# EAGLE design FireflyRevB (EAGLE 9.0.1)
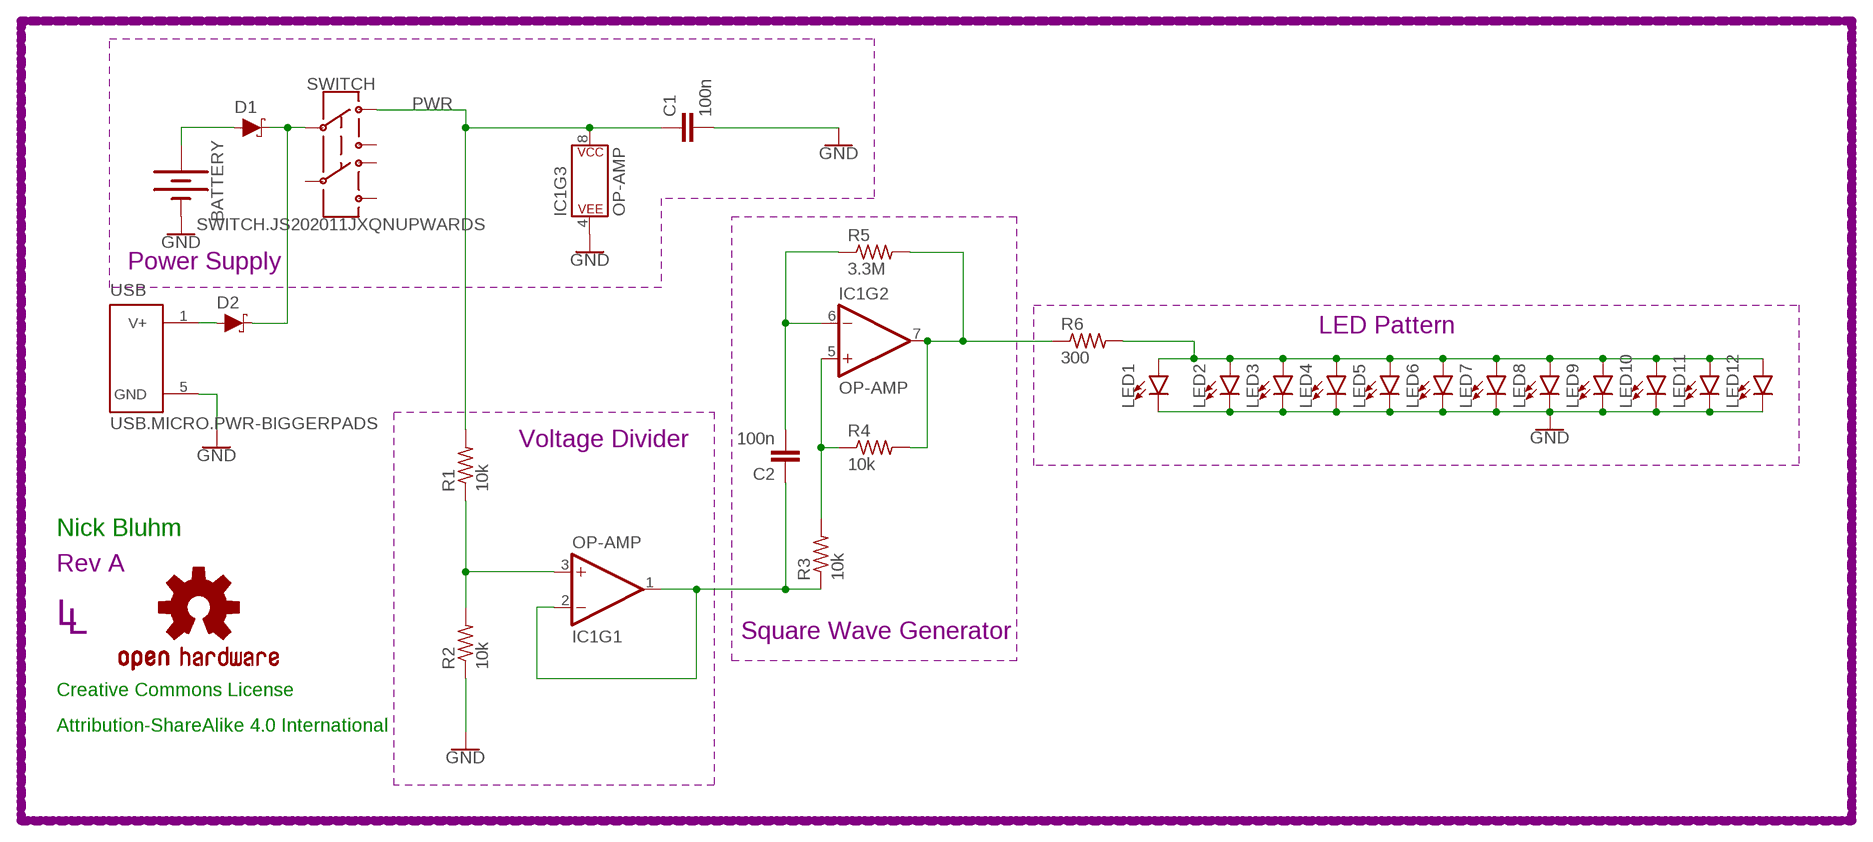
[diagram p0: schematic, sheet 1]

## Parts
BATTERY  BATTERY-20MM_SMD  [BATTCON_20MM]
C1  100n  CAPACITOR0603  [C0603]
C2  100n  CAPACITOR0603  [C0603]
D1  SCHOTTKY-USC  [USC]
D2  SCHOTTKY-USC  [USC]
IC1  OP-AMP  OPAMP-DUALU  [SO08]
LED1  LED5MM  [LED_5MM]
LED2  LED5MM  [LED_5MM]
LED3  LED5MM  [LED_5MM]
LED4  LED5MM  [LED_5MM]
LED5  LED5MM  [LED_5MM]
LED6  LED5MM  [LED_5MM]
LED7  LED5MM  [LED_5MM]
LED8  LED5MM  [LED_5MM]
LED9  LED5MM  [LED_5MM]
LED10  LED5MM  [LED_5MM]
LED11  LED5MM  [LED_5MM]
LED12  LED5MM  [LED_5MM]
LOGO1  OSHW-LOGOL-COPPER  [OSHW-LOGO-L_COPPER]
R1  10k  RESISTOR0603  [R0603]
R2  10k  RESISTOR0603  [R0603]
R3  10k  RESISTOR0603  [R0603]
R4  10k  RESISTOR0603  [R0603]
R5  3.3M  RESISTOR0603  [R0603]
R6  300  RESISTOR0603  [R0603]
SWITCH  SWITCH.JS202011JXQNUPWARDS  [SWITCH.00]
U$4  REVISION.A  [REV.A]
U$5  LINNES.LAB.LOGO  [LINNES.LAB.LOGO]
USB  USB.MICRO.PWR-BIGGERPADS  [USB-MICRO-01.BIGGERPADS.PWR]

## Nets
GND: BATTERY.2(-) C1.2 IC1.4(P$V-) LED1.K(C) LED2.K(C) LED3.K(C) LED4.K(C) LED5.K(C) LED6.K(C) LED7.K(C) LED8.K(C) LED9.K(C) LED10.K(C) LED11.K(C) LED12.K(C) R2.1 USB.5(GND)
N$1: D1.-(C) D2.-(C) SWITCH.2
N$2: IC1.3(+IN) R1.1 R2.2
N$3: LED1.A LED2.A LED3.A LED4.A LED5.A LED6.A LED7.A LED8.A LED9.A LED10.A LED11.A LED12.A R6.2
N$4: C2.1 IC1.1(OUT) IC1.2(-IN) R3.1
N$5: C2.2 IC1.6(-IN) R5.1
N$6: IC1.5(+IN) R3.2 R4.1
N$7: IC1.7(OUT) R4.2 R5.2 R6.1
N$9: BATTERY.1(+) D1.+(A)
N$11: D2.+(A) USB.1(V+)
PWR: C1.1 IC1.8(P$V+) R1.2 SWITCH.1
Unconnected: SWITCH.3 SWITCH.5 SWITCH.6 SWITCH.7

## Notes on the sheet
- Power Supply
- LED Pattern
- Voltage Divider
- Nick Bluhm
- Square Wave Generator
- Creative Commons License
- Attribution-ShareAlike 4.0 International

## Library data of the parts
BATTERY = SparkFun-Batteries:BATTERY: Battery - Single Cell A variety of battery chemistries, sizes, and footprints. Device List: 20MM_PTH - Coin Cell Battery Holder - 20mm (PTH) <https://www.sparkfun.com/products/783> 6.8MM_PTH - Coin Cell Battery Holder - 6.8MM(SMD) <https://www.digikey.com/product-detail/en/seiko-instruments/MS621FE-FL11E/728-1057-ND/1889208?WT.srch=1&gclid=CNOQ5a6LzdQCFZS2wAodXCkE0g> 12MM_SMD - Coin Cell Battery Holder - 12mm (SMD) <https://www.sparkfun.com/products/10592> 12MM_PTH - Coin Cell Battery Holder - 12mm (PTH) <https://www.sparkfun.com/products/7948> 20MM_SMD - 20mm Coin Cell Battery Holder (SMD) (2 legs) Used on the Big Time Watch Kit <https://www.sparkfun.com/products/11734> 20MM_SMD_4LEGS - Coin Cell Battery Holder - 20mm (SMD) <https://www.sparkfun.com/products/11892> 20MM_SMD_4LEGS_OVERPASTE - Coin Cell Battery Holder - 20mm (SMD) <https://www.sparkfun.com/products/11892> (Over-paste on the legs) 24.5MM_PTH - Coin Cell Battery Holder - 24.5mm (PTH) <https://www.sparkfun.com/products/8863> 9V - 9V Battery Holder - PC Mount Used on the SparkFun SparkPunk Sound Kit <https://www.sparkfun.com/products/11177> and SparkFun SparkPunk Sequencer Kit <https://www.sparkfun.com/products/12707> 18650 - Battery Holder - 18650 (PTH) <https://www.sparkfun.com/products/13113> AA - Battery Holder - 1xAA (PTH) <https://www.sparkfun.com/products/7949> AAA - Battery Holder - 1xAAA (PTH) <https://www.sparkfun.com/products/12718> AA_KIT - Battery Holder - 1xAA (PTH) <https://www.sparkfun.com/products/7949> Special kit package - pads only have exposed copper on one side of the board. AAA_KIT - Battery Holder - 1xAAA (PTH) <https://www.sparkfun.com/products/12718> Special kit package - pads only have exposed copper on one side of the board.; PROD_ID: BATT-11519
C1 C2 = CalvEngIO-Passives:CAPACITOR
D1 D2 = CalvEngIO-DiscreteSemi:SCHOTTKY: Schottky diode A Schottky diode is a semiconductor diode which has a low forward voltage drop and a very fast switching action. Example: Digi-Key Part Number: RB161MM-20CT-ND
IC1 = SparkFun-IC-Amplifiers:OPAMP-DUAL: Generic op-amp footprint This component is for the standard 358 pinning of a dual op-amp From the LM358 datasheet: Pin 1: Output A Pin 2: Inverting Input A Pin 3: Non-Inverting Input A Pin 4: Gnd Pin 5: Non-Inverting Input B Pin 6: Inverting Input B Pin 7: Output B Pin 8: V+; PROD_ID: NA-XXXXX
LED1-LED12 = CalvEngIO-LED:LED: LED (Generic) Standard schematic elements and footprints for 5mm, 3mm, 1206, and 0603 sized LEDs. Generic LEDs with no color specified. LTST-C190KGKT: arrow indicates cathode
LOGO1 = CalvEngIO-Logos:OSHW-LOGO: Open-Source Hardware (OSHW) Logo This logo indicates the piece of hardware it is found on incorporates a OSHW license and/or adheres to the definition of open source hardware found here: http://freedomdefined.org/OSHW
R1-R6 = CalvEngIO-Passives:RESISTOR
SWITCH = CalvEngIO-Switches:SWITCH.JS202011JXQN: Manufacturer's Part Numer: JS202011JAQN for right angle throw JS202011JCQN for top side throw
U$4 = CalvEngIO-Symbols:REVISION.A
U$5 = CalvEngIO-Logos:LINNES.LAB.LOGO
USB = CalvEngIO-Connectors:USB.MICRO.PWR

## Board
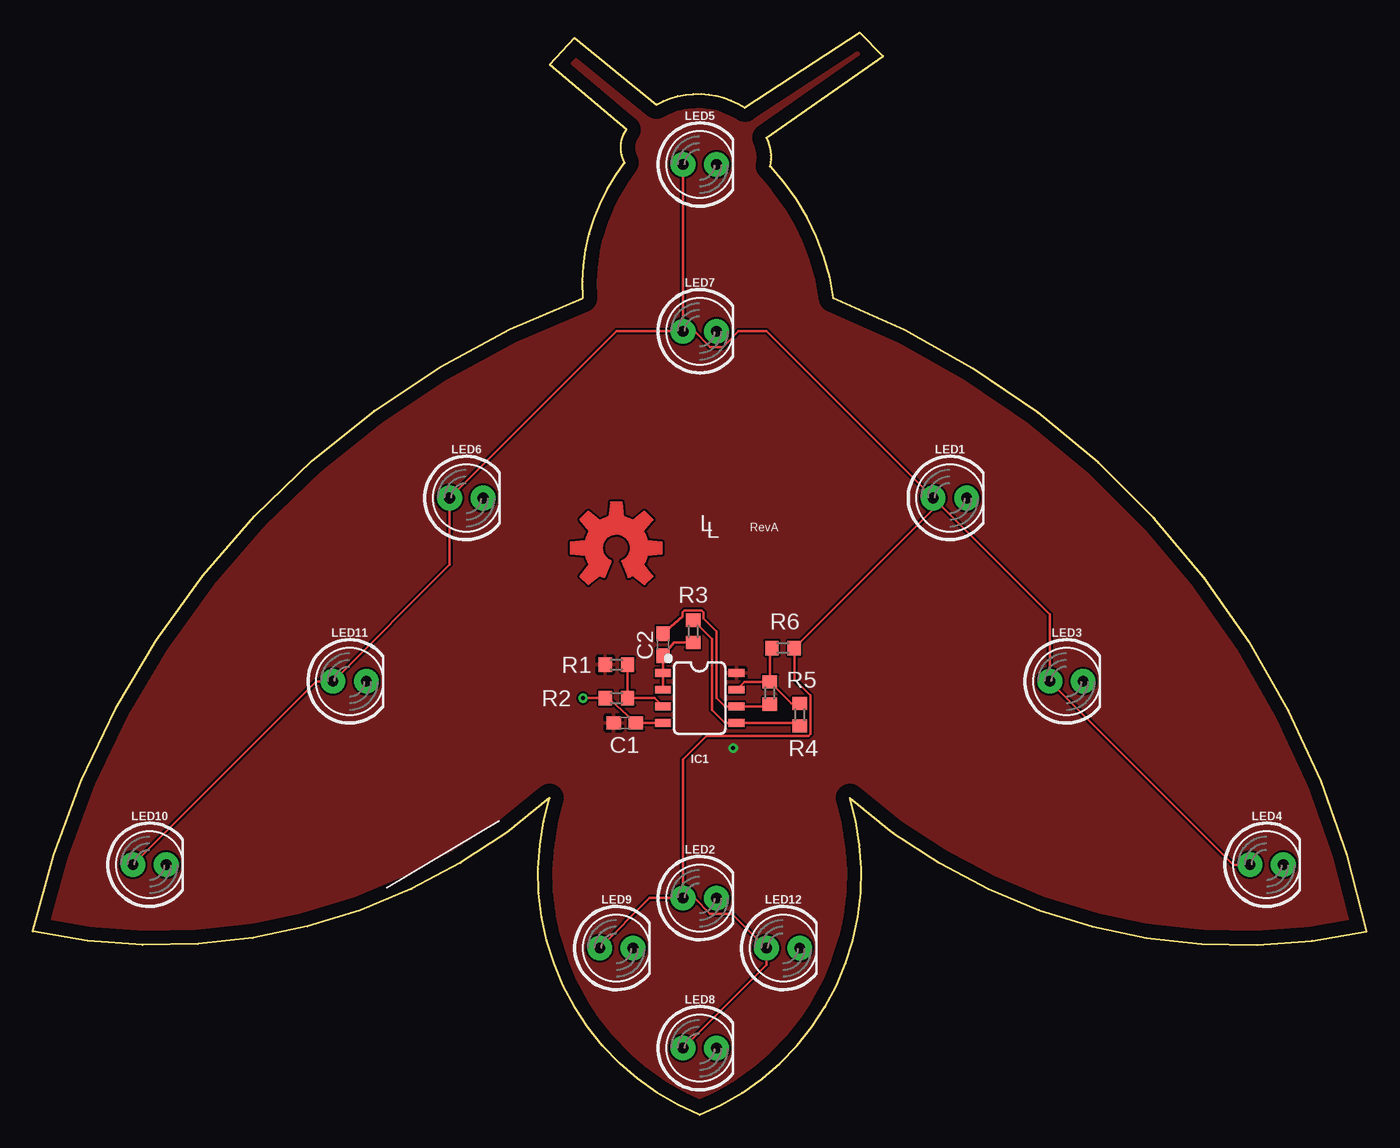
[diagram p1: board, top side]
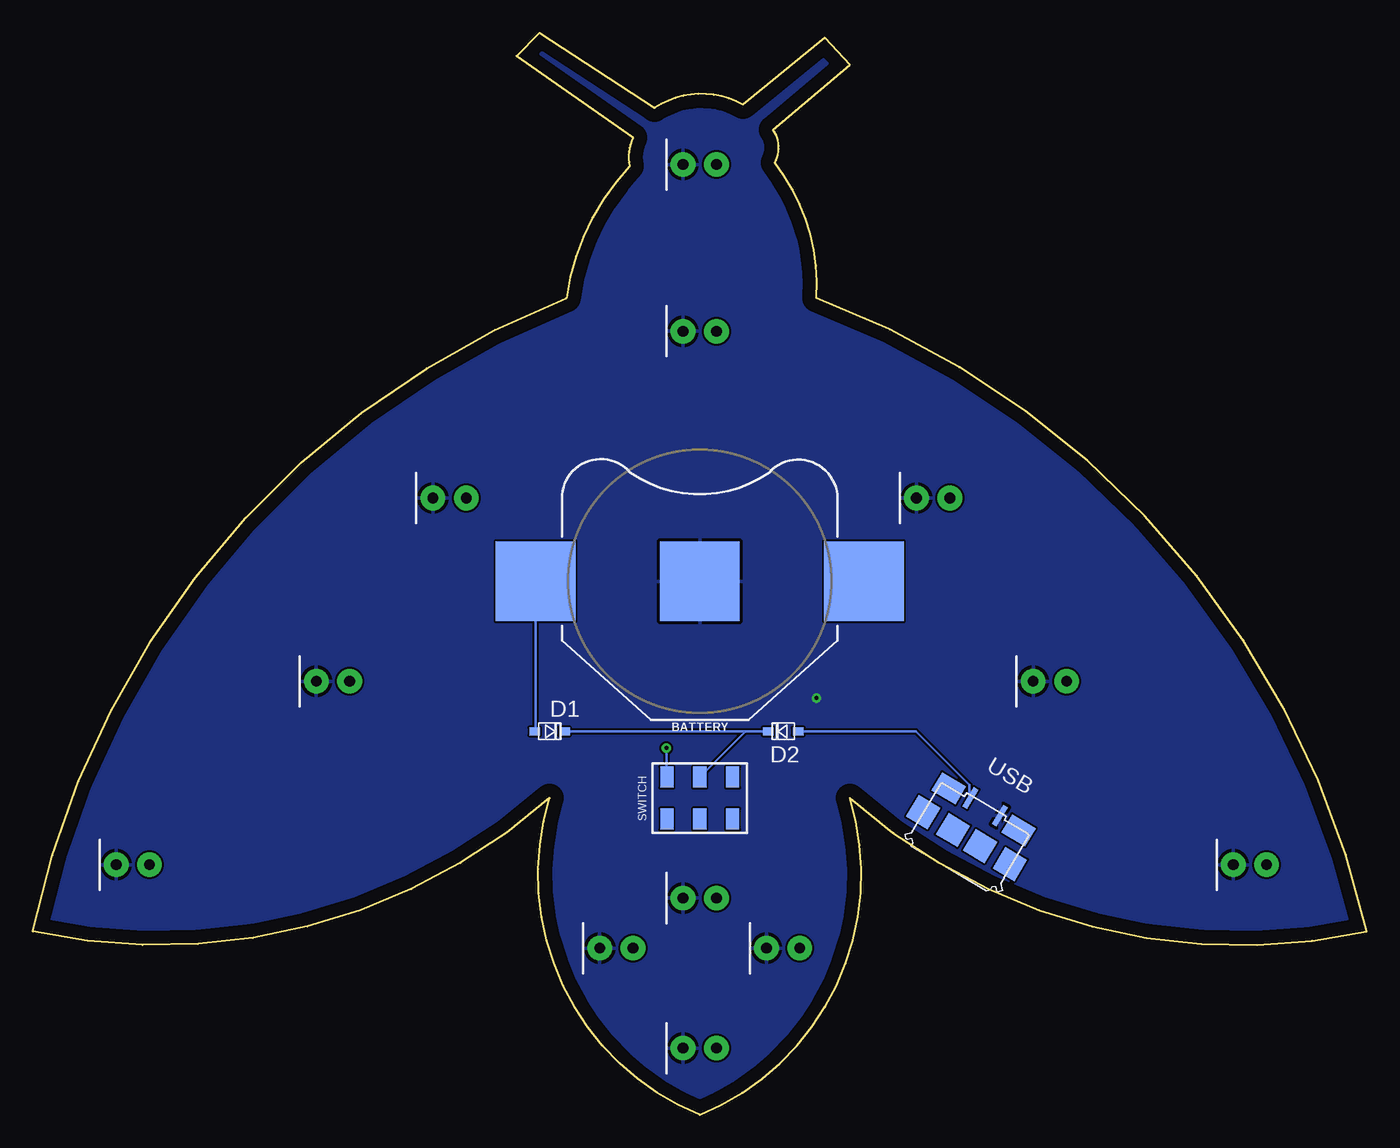
[diagram p2: board, bottom side, seen from below]

Size 101.6 x 82.42 mm. Coordinates in mm from the lower left corner, seen from the top.
Outline: 55.88,74.42 64.77,80.64 62.99,82.42 54.23,76.71 arc62 47.5,76.96 41.27,82.04 39.37,80.01 45.21,75.06 arc63 45.09,72.52 arc42 41.91,62.23 arc57 0,13.97 arc54 39.37,24.13 arc85 50.8,0 arc85 62.23,24.13 arc54 101.6,13.97 arc57 60.96,62.23 arc36 56.13,72.26 arc41 55.88,74.42
Copper layers (1*16): Top 0.035mm / dielectric 1.5mm / Bottom 0.035mm
Design rules "default": minimum track width 6mil, minimum drill 0.35mm, track to track 6mil, track to pad 6mil, pad to pad 6mil, via to via 6mil, smd to smd 6mil, copper to edge 40mil, drill to drill 6mil, minimum pad ring 10mil, minimum via ring 8mil, stop-mask expansion 4mil, vias tented up to drill 0mil, thermal gap 10mil

### Footprints (pad centres in the part's own frame; a part is rotated, then mirrored left to right if it is on the bottom)
BATTCON_20MM = smd 6.07 x 6.07: 1 -12.5,0; 2 0,0; 3 12.5,0
C0603 = smd 1.1 x 1: 1 -0.85,0; 2 0.85,0
USC = smd 0.8 x 0.6: + -1.15,0; - 1.15,0
SO08 = smd 0.6 x 1.2: 1 -1.905,-2.8; 2 -0.635,-2.8; 3 0.635,-2.8; 4 1.905,-2.8; 5 1.905,2.8; 6 0.635,2.8; 7 -0.635,2.8; 8 -1.905,2.8
LED_5MM = drill 0.813 pad 1.88: A -1.27,0; K 1.27,0
R0603 = smd 1 x 1.1: 1 -0.85,0; 2 0.85,0
SWITCH.00 = smd 1 x 1.6: 1 -2.5,1.6; 2 0,1.6; 3 2.5,1.6; 5 -2.5,-1.6; 6 0,-1.6; 7 2.5,-1.6
USB-MICRO-01.BIGGERPADS.PWR = smd 0.4 x 1.7: 1 -1.3,2.775; 5 1.3,2.775 | smd 1.9 x 1.9: SOLDER-1 -3.85,0; SOLDER-2 -1.2,0; SOLDER-3 1.2,0; SOLDER-4 3.85,0 | smd 2.1 x 1.6: SOLDER-5 -3.1,2.55; SOLDER-6 3.1,2.55

### Placement (x,y rotation side)
BATTERY  50.8,40.64 0 bottom
C1  45.09,29.84 0 top
C2  48.01,35.81 90 top
D1  62.23,29.21 0 bottom
D2  44.45,29.21 180 bottom
IC1  50.8,31.75 270 top
LED1  69.85,46.99 0 top
LED2  50.8,16.51 0 top
LED3  78.74,33.02 0 top
LED4  93.98,19.05 0 top
LED5  50.8,72.39 0 top
LED6  33.02,46.99 0 top
LED7  50.8,59.69 0 top
LED8  50.8,5.08 0 top
LED9  44.45,12.7 0 top
LED10  8.89,19.05 0 top
LED11  24.13,33.02 0 top
LED12  57.15,12.7 0 top
LOGO1  44.45,43.18 0 top
R1  44.45,34.29 180 top
R2  44.45,31.75 0 top
R3  50.29,36.83 90 top
R4  58.42,30.48 90 top
R5  56.13,32.13 90 top
R6  57.15,35.56 0 top
SWITCH  50.8,24.13 0 bottom
U$4  54.61,44.45 0 top
U$5  50.8,44.45 0 top
USB  30.48,21.08 329.1 bottom

### Tracks (layer width: path | path; a pad name or v marks a point on that pad's centre or on a via)
GND  (via drill 0.3)
  Top 0.203: IC1.4 C1.2 43.83,31.75 R2.1 v41.91,31.75
  pour Bottom: 0,99.06 173.99,99.06 175.26,97.79 175.26,-6.35 166.37,-15.24 6.35,-15.24 -3.81,-5.08 -3.81,93.98 0,97.79
N$1
  Bottom 0.203: D1.- D2.- 47.32,29.21 SWITCH.2
N$2
  Top 0.203: IC1.3 47.36,31.75 R2.2 R1.1
N$3
  Top 0.203: LED10.A 21.59,33.02 LED11.A 31.75,41.91 LED6.A 44.45,59.69 LED7.A | LED7.A LED5.A | LED1.A 55.88,59.69 53.76,59.69 52.56,58.5 51.58,58.5 50.38,59.69 LED7.A | LED1.A 77.47,38.1 LED3.A 91.44,19.05 LED4.A | LED8.A 55.88,11.43 LED12.A 53.26,15.32 51.58,15.32 50.38,16.51 LED2.A | LED2.A 46.99,16.51 LED9.A | LED2.A 49.53,27.09 51.32,28.88 59.07,28.88 59.22,29.02 59.22,31.94 58,33.16 R6.2 68.58,46.14 LED1.A
N$4
  Top 0.203: IC1.2 IC1.1 C2.1 48.82,35.98 R3.1
N$5
  Top 0.203: IC1.6 | C2.2 49.49,37.95 49.49,38.29 49.64,38.43 50.95,38.43 51.1,38.29 51.1,37.8 52.07,36.83 52.07,31.75 52.7,31.12 IC1.6 | IC1.6 55.97,31.12 R5.1
N$6
  Top 0.203: 53.6,29.86 IC1.5 | IC1.5 52.7,29.84 51.71,30.84 51.71,36.26 R3.2 | IC1.5 58.2,29.84 R4.1
N$7
  Top 0.203: IC1.7 54.2,32.98 R5.2 | R5.2 56.13,35.39 R6.1 | R5.2 57.78,31.33 R4.2
N$9
  Bottom 0.203: BATTERY.1 63.3,29.29 D1.+
N$11
  Bottom 0.203: USB.1 30.25,24.21 30.25,25.12 34.34,29.21 D2.+
PWR  (via drill 0.3)
  Bottom 0.203: SWITCH.1 53.34,25.77 v53.34,27.94
  pour Top: 0,100.33 0,-15.24 181.61,-15.24 181.61,97.79 2.54,97.79